# EAGLE design milton (EAGLE 8.4.1)
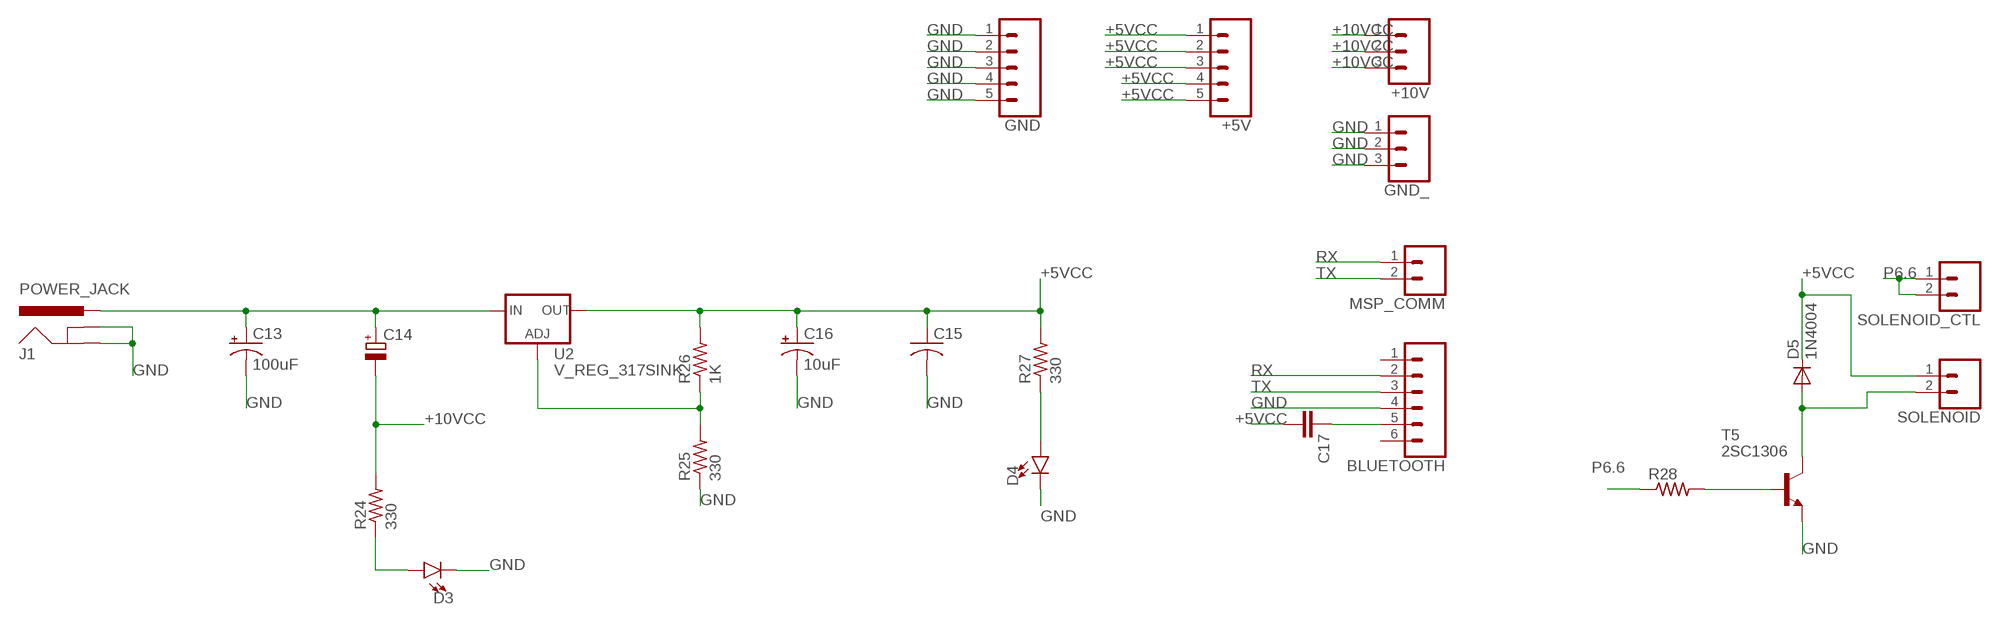
[diagram p0: schematic, sheet 1]

## Parts
+5V  CONN_05  [1X05]
+10V  CONN_03  [1X03]
BLUETOOTH  CONN_06SILK_FEMALE_PTH  [1X06]
C13  100uF  100UF-POLAR-RADIAL-2.5MM-25V-20%  [CPOL-RADIAL-2.5MM-6.5MM]
C14  CPOL-EUE5-6  [E5-6]
C15  C-US050-030X075  [C050-030X075]
C16  10uF  10UF-POLAR-RADIAL-2.5MM-25V-20%  [CPOL-RADIAL-2.5MM-5MM]
C17  C5/3  [C5B3]
D3  LED-RED1206  [LED-1206]
D4  LED-RED1206  [LED-1206]
D5  1N4004  [DO41-10]
GND  CONN_05  [1X05]
GND_  CONN_03  [1X03]
J1  POWER_JACK  [POWER_JACK_PTH]
MSP_COMM  CONN_02  [1X02]
R24  330  R-US_0207/10  [0207/10]
R25  330  R-US_0207/10  [0207/10]
R26  1K  R-US_0207/10  [0207/10]
R27  330  R-US_0207/10  [0207/10]
R28  R-US_0207/10  [0207/10]
SOLENOID  CONN_02  [1X02]
SOLENOID_CTL  CONN_02  [1X02]
T5  2SC1306  [TO220BV]
U2  V_REG_317SINK  [TO220-ADJ]

## Nets
+5VCC: +5V.1 +5V.2 +5V.3 +5V.4 +5V.5 C15.1 C16.1(+) C17.2 D5.C R26.2 R27.2 SOLENOID.1 U2.OUT
+10VCC: +10V.1 +10V.2 +10V.3 C14.- R24.2
GND: BLUETOOTH.4 C13.2(-) C15.2 C16.2(-) D3.C D4.C GND.1 GND.2 GND.3 GND.4 GND.5 GND_.1 GND_.2 GND_.3 J1.GND J1.GNDBREAK R25.1 T5.3(E)
N$22: C13.1(+) C14.+ J1.PWR U2.IN
N$25: D4.A R27.1
N$26: R25.2 R26.1 U2.ADJ
N$28: D3.A R24.1
N$29: BLUETOOTH.5 C17.1
N$30: R28.2 T5.1(B)
N$32: D5.A SOLENOID.2 T5.2(C)
P6.6: R28.1 SOLENOID_CTL.1 SOLENOID_CTL.2
RX: BLUETOOTH.2 MSP_COMM.1
TX: BLUETOOTH.3 MSP_COMM.2
Unconnected: BLUETOOTH.1 BLUETOOTH.6

## Library data of the parts
+5V GND = SparkFun-Connectors:CONN_05: Multi connection point. Often used as Generic Header-pin footprint for 0.1 inch spaced/style header connections On any of the 0.1 inch spaced packages, you can populate with these: Break Away Headers - Straight <https://www.sparkfun.com/products/116> (PRT-00116) Break Away Male Headers - Right Angle <https://www.sparkfun.com/products/553> (PRT-00553) Female Headers <https://www.sparkfun.com/products/115> (PRT-00115) Break Away Headers - Machine Pin <https://www.sparkfun.com/products/117> (PRT-00117) Break Away Female Headers - Swiss Machine Pin <https://www.sparkfun.com/products/743> (PRT-00743) For SCREWTERMINALS and SPRING TERMINALS visit here: Screw Terimnals on SparkFun.com <https://www.sparkfun.com/search/results?term=Screw+Terminals> (5mm/3.5mm/2.54mm spacing) This device is also useful as a general connection point to wire up your design to another part of your project. Our various solder wires solder well into these plated through hole pads. Hook-Up Wire - Assortment (Stranded, 22 AWG) <https://www.sparkfun.com/products/11375> (PRT-11375) Hook-Up Wire - Assortment (Solid Core, 22 AWG) <https://www.sparkfun.com/products/11367> (PRT-11367) View the entire wire category on our website here <https://www.sparkfun.com/categories/141> Special notes: Molex polarized connector foot print use with SKU : PRT-08231 with associated crimp pins and housings. 1MM SMD Version SKU: PRT-10208
+10V GND_ = SparkFun-Connectors:CONN_03: Multi connection point. Often used as Generic Header-pin footprint for 0.1 inch spaced/style header connections On any of the 0.1 inch spaced packages, you can populate with these: Break Away Headers - Straight <https://www.sparkfun.com/products/116> (PRT-00116) Break Away Male Headers - Right Angle <https://www.sparkfun.com/products/553> (PRT-00553) Female Headers <https://www.sparkfun.com/products/115> (PRT-00115) Break Away Headers - Machine Pin <https://www.sparkfun.com/products/117> (PRT-00117) Break Away Female Headers - Swiss Machine Pin <https://www.sparkfun.com/products/743> (PRT-00743) Stackable Header - 3 Pin (Female, 0.1") <https://www.sparkfun.com/products/13875> (PRT-13875) For SCREWTERMINALS and SPRING TERMINALS visit here: Screw Terimnals on SparkFun.com <https://www.sparkfun.com/search/results?term=Screw+Terminals> (5mm/3.5mm/2.54mm spacing) This device is also useful as a general connection point to wire up your design to another part of your project. Our various solder wires solder well into these plated through hole pads. Hook-Up Wire - Assortment (Stranded, 22 AWG) <https://www.sparkfun.com/products/11375> (PRT-11375) Hook-Up Wire - Assortment (Solid Core, 22 AWG) <https://www.sparkfun.com/products/11367> (PRT-11367) View the entire wire category on our website here <https://www.sparkfun.com/categories/141> Special notes: Molex polarized connector foot print use with SKU : PRT-08232 with associated crimp pins and housings.
BLUETOOTH = SparkFun-Connectors:CONN_06: Multi connection point. Often used as Generic Header-pin footprint for 0.1 inch spaced/style header connections On any of the 0.1 inch spaced packages, you can populate with these: Break Away Headers - Straight <https://www.sparkfun.com/products/116> (PRT-00116) Break Away Male Headers - Right Angle <https://www.sparkfun.com/products/553> (PRT-00553) Female Headers <https://www.sparkfun.com/products/115> (PRT-00115) Break Away Headers - Machine Pin <https://www.sparkfun.com/products/117> (PRT-00117) Break Away Female Headers - Swiss Machine Pin <https://www.sparkfun.com/products/743> (PRT-00743) Arduino Stackable Header - 6 Pin <https://www.sparkfun.com/products/9280> (PRT-09280) For SCREWTERMINALS and SPRING TERMINALS visit here: Screw Terimnals on SparkFun.com <https://www.sparkfun.com/search/results?term=Screw+Terminals> (5mm/3.5mm/2.54mm spacing) This device is also useful as a general connection point to wire up your design to another part of your project. Our various solder wires solder well into these plated through hole pads. Hook-Up Wire - Assortment (Stranded, 22 AWG) <https://www.sparkfun.com/products/11375> (PRT-11375) Hook-Up Wire - Assortment (Solid Core, 22 AWG) <https://www.sparkfun.com/products/11367> (PRT-11367) View the entire wire category on our website here <https://www.sparkfun.com/categories/141>; PROD_ID: CONN-08437
C13 = SparkFun-Capacitors:100UF-POLAR: 100µF polarized capacitors A capacitor is a passive two-terminal electrical component used to store electrical energy temporarily in an electric field.; PROD_ID: CAP-08439
C14 = resistor:CPOL-EU: POLARIZED CAPACITOR, European symbol
C15 = resistor:C-US: CAPACITOR, American symbol
C16 = SparkFun-Capacitors:10UF-POLAR: 10.0µF polarized capacitors A capacitor is a passive two-terminal electrical component used to store electrical energy temporarily in an electric field.; PROD_ID: CAP-08440
C17 = capacitor-wima:C: CAPACITOR naming: grid - package width
D3 D4 = SparkFun-LED:LED-RED: Red SMD LED Used in manufacturing of most products at SparkFun Packages: 0603 - SMD 0603 package [Product Link] <http://docs.avagotech.com/docs/AV02-0551EN> 0603 SMART - SMD 0603 SMART package ( more efficient and expensive)[Product Link] <http://www.osram-os.com/Graphics/XPic2/00077099_0.pdf> 1206 - SMD1206 package [Product Link] <https://www.sparkfun.com/datasheets/DevTools/LilyPad/Q150OVS4.pdff> SparkFun Products: Pro Mini 328 -5V <https://www.sparkfun.com/products/821> RedBoard <https://www.sparkfun.com/products/12757> IOIO-OTG <https://www.sparkfun.com/products/13613>; PROD_ID: DIO-09912; VALUE: RED
D5 = adafruit:1N4004: DIODE General purpose 1N400x type rectifier (With bigger pads) http://www.ladyada.net/library/pcb/eaglelibrary.html
J1 = SparkFun-Connectors:POWER_JACK: Power Jack Connector This is the standard 5.5mm barrel jack for power. The PTH is the most common, proven, reliable, footprint. The Slot footprint only works if the mill layer is transmitted to the PCB fab house so be warned. Here are the connectors we sell at SparkFun: DC Barrel Power Jack/Connector <https://www.sparkfun.com/products/119> (PRT-00119) DC Barrel Power Jack/Connector (SMD) <https://www.sparkfun.com/products/12748> (PRT-12748) DC Barrel Jack Adapter - Breadboard Compatible <https://www.sparkfun.com/products/10811> (PRT-10811) It is used on this SparkFun product (and many, many others): SparkFun RedBoard - Programmed with Arduino <https://www.sparkfun.com/products/12757> (DEV-12757) Also, if you need a mating power supply or connector, please check these out: Wall Adapter Power Supply - 9VDC 650mA <https://www.sparkfun.com/products/298> (TOL-00298) DC Barrel Jack Adapter - Male <https://www.sparkfun.com/products/10287> (PRT-10287); PROD_ID: CONN-08197
MSP_COMM SOLENOID SOLENOID_CTL = SparkFun-Connectors:CONN_02: Multi connection point. Often used as Generic Header-pin footprint for 0.1 inch spaced/style header connections On any of the 0.1 inch spaced packages, you can populate with these: Break Away Headers - Straight <https://www.sparkfun.com/products/116> (PRT-00116) Break Away Male Headers - Right Angle <https://www.sparkfun.com/products/553> (PRT-00553) Female Headers <https://www.sparkfun.com/products/115> (PRT-00115) Break Away Headers - Machine Pin <https://www.sparkfun.com/products/117> (PRT-00117) Break Away Female Headers - Swiss Machine Pin <https://www.sparkfun.com/products/743> (PRT-00743) For SCREWTERMINALS and SPRING TERMINALS visit here: Screw Terimnals on SparkFun.com <https://www.sparkfun.com/search/results?term=Screw+Terminals> (5mm/3.5mm/2.54mm spacing) This device is also useful as a general connection point to wire up your design to another part of your project. Our various solder wires solder well into these plated through hole pads. Hook-Up Wire - Assortment (Stranded, 22 AWG) <https://www.sparkfun.com/products/11375> (PRT-11375) Hook-Up Wire - Assortment (Solid Core, 22 AWG) <https://www.sparkfun.com/products/11367> (PRT-11367) View the entire wire category on our website here <https://www.sparkfun.com/categories/141> Special notes: Molex polarized connector foot print use with: PRT-08233 with associated crimp pins and housings. 2.54_SCREWTERM for use with PRT-10571. 3.5mm Screw Terminal footprints for PRT-08084 5mm Screw Terminal footprints for use with PRT-08432
R24-R28 = resistor:R-US_: RESISTOR, American symbol
T5 = transistor:2SC1306: NPN Transistor Final RF Power Outupt Source: 2sc1306.pdf
U2 = SparkFun-IC-Power:V_REG_317: Voltage Regulator Standard LM317 adjustable voltage regulator. AOI (Adjust Output Input). Google 'LM317 Calculator' for easy to use app to get the two resistor values needed. 240/720 for 5V output. 240/390 for 3.3V output. Spark Fun Electronics SKU : COM-00527

## Board
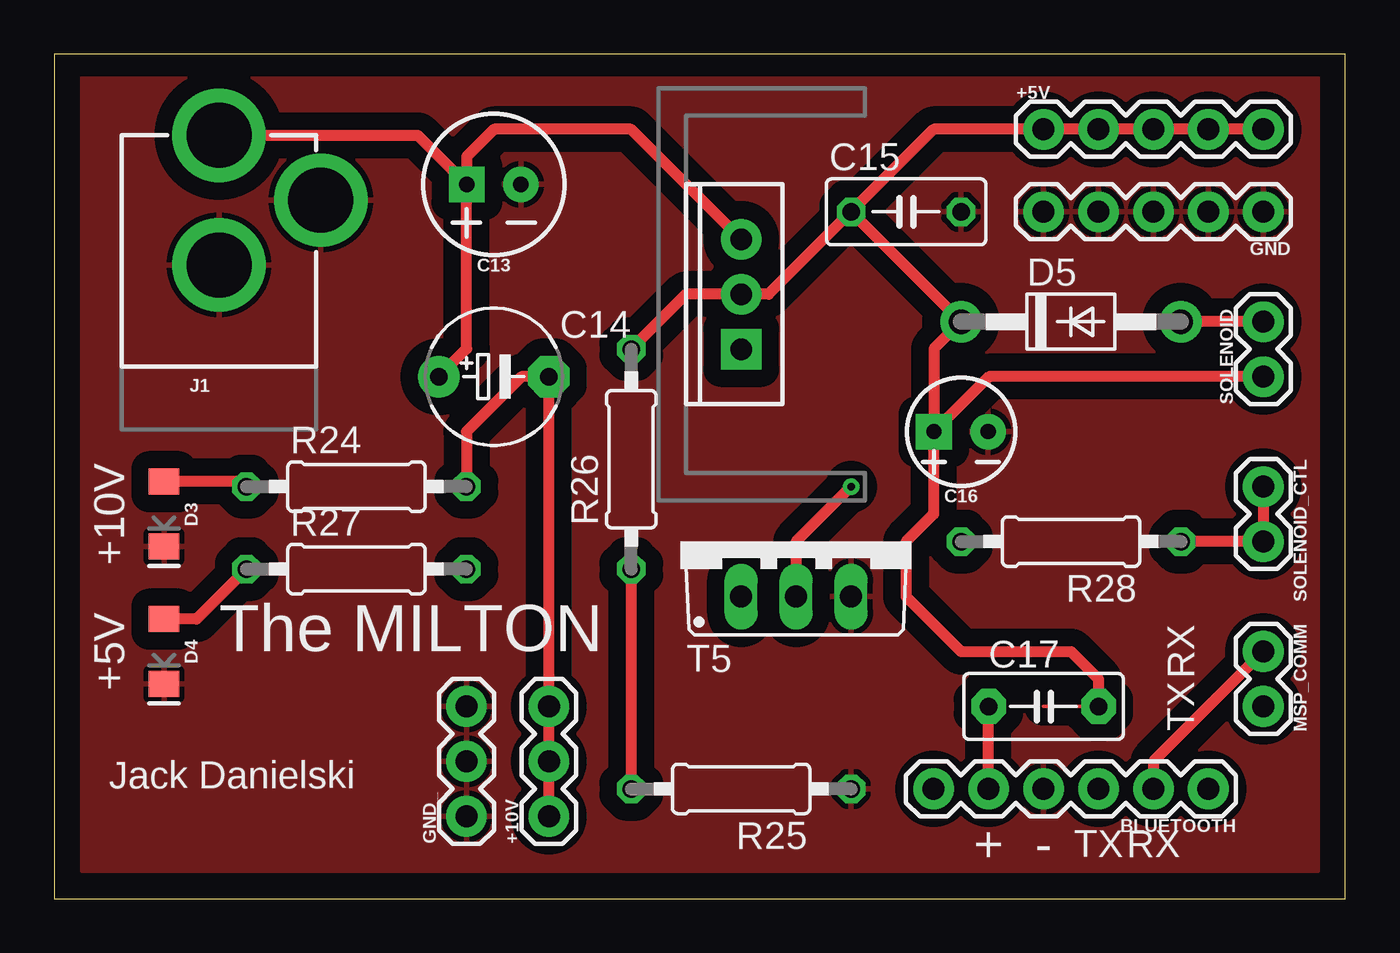
[diagram p1: board, top side]
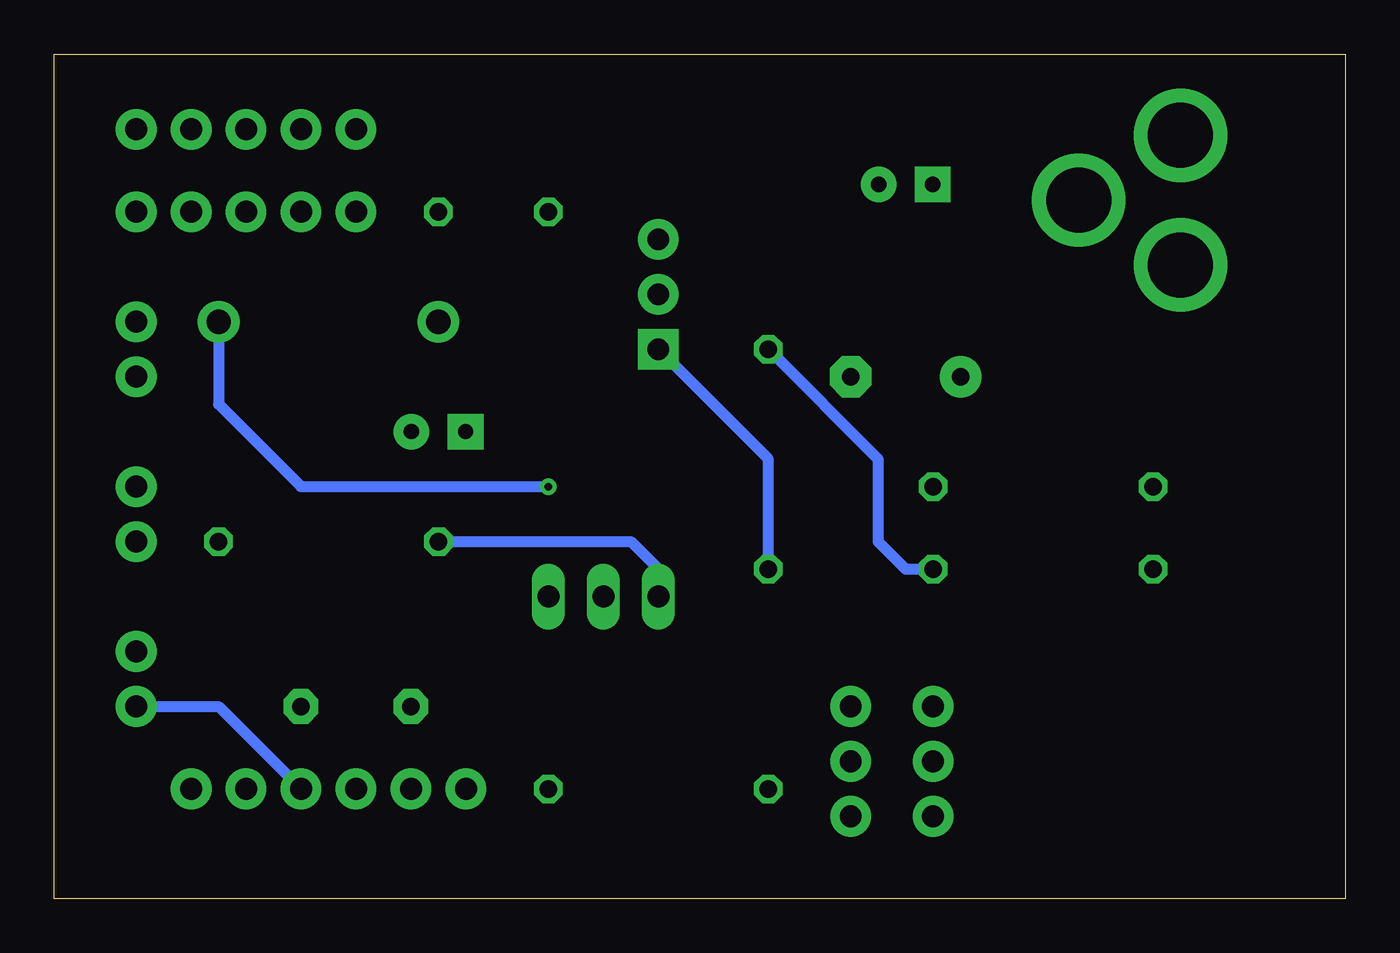
[diagram p2: board, bottom side, seen from below]

Size 59.67 x 39.04 mm. Coordinates in mm from the lower left corner, seen from the top.
Outline: 0,0 59.67,0 59.67,39.04 0,39.04 0,0
Copper layers (1*16): Top 0.035mm / dielectric 1.5mm / Bottom 0.035mm
Design rules "default": minimum track width 6mil, minimum drill 0.35mm, track to track 6mil, track to pad 6mil, pad to pad 6mil, via to via 6mil, smd to smd 6mil, copper to edge 40mil, drill to drill 6mil, minimum pad ring 10mil, minimum via ring 8mil, stop-mask expansion 4mil, vias tented up to drill 0mil, thermal gap 10mil

### Footprints (pad centres in the part's own frame; a part is rotated, then mirrored left to right if it is on the bottom)
1X05 = drill 1.016 pad 1.88: 1 0,0; 2 2.54,0; 3 5.08,0; 4 7.62,0; 5 10.16,0
1X03 = drill 1.016 pad 1.88: 1 0,0; 2 2.54,0; 3 5.08,0
1X06 = drill 1.016 pad 1.88: 1 0,0; 2 2.54,0; 3 5.08,0; 4 7.62,0; 5 10.16,0; 6 12.7,0
CPOL-RADIAL-2.5MM-6.5MM = drill 0.7 pad 1.651 square: 1 1.25,0 | drill 0.7 pad 1.651: 2 -1.25,0
E5-6 = drill 0.813 pad 1.905: + -2.54,0 | drill 0.813 pad 1.905 octagon: - 2.54,0
C050-030X075 = drill 0.813 octagon: 1 -2.54,0; 2 2.54,0
CPOL-RADIAL-2.5MM-5MM = drill 0.7 pad 1.651 square: 1 1.25,0 | drill 0.7 pad 1.651: 2 -1.25,0
C5B3 = drill 0.813 pad 1.6 octagon: 1 -2.54,0; 2 2.54,0
LED-1206 = smd 1.2 x 1.4: A -1.5,0; C 1.5,0
DO41-10 = drill 1.118 pad 1.93: A 5.08,0; C -5.08,0
POWER_JACK_PTH = drill 2.997 pad 4.318: GND 0,7.7; GNDBREAK 4.7,10.7; PWR 0,13.7
1X02 = drill 1.016 pad 1.88: 1 0,0; 2 2.54,0
0207/10 = drill 0.813 octagon: 1 -5.08,0; 2 5.08,0
TO220BV = drill 1.016 long: 1 -2.54,-2.54; 2 0,-2.54; 3 2.54,-2.54
TO220-ADJ = drill 1 pad 1.88 square: ADJ -2.54,0 | drill 1 pad 1.88: IN 2.54,0; OUT 0,0

### Placement (x,y rotation side)
+5V  45.72,35.56 0 top
+10V  22.86,3.81 90 top
BLUETOOTH  53.34,5.08 180 top
C13  20.32,33.02 180 top
C14  20.32,24.13 0 top
C15  39.37,31.75 0 top
C16  41.91,21.59 180 top
C17  45.72,8.89 0 top
D3  5.08,17.78 270 top
D4  5.08,11.43 270 top
D5  46.99,26.67 0 top
GND  55.88,31.75 180 top
GND_  19.05,3.81 90 top
J1  7.62,21.59 0 top
MSP_COMM  55.88,11.43 270 top
R24  13.97,19.05 0 top
R25  31.75,5.08 180 top
R26  26.67,20.32 90 top
R27  13.97,15.24 0 top
R28  46.99,16.51 180 top
SOLENOID  55.88,24.13 90 top
SOLENOID_CTL  55.88,19.05 270 top
T5  34.29,16.51 0 top
U2  31.75,27.94 90 top

### Tracks (layer width: path | path; a pad name or v marks a point on that pad's centre or on a via)
+5VCC
  Top 0.152: C16.1 40.64,21.57 | C17.2 45.72,8.89
  Top 0.508: C16.1 40.66,25.42 D5.C C15.1 | SOLENOID.1 43.2,24.13 C16.1 | R26.2 29.21,27.94 U2.OUT 33.02,27.94 C15.1 | C15.1 40.64,35.56 +5V.1 +5V.2 +5V.3 +5V.4 +5V.5 | C16.1 40.64,21.57 40.64,17.78 39.37,16.51 39.37,13.97 41.91,11.43 46.99,11.43 48.26,10.16 C17.2
  Bottom 0.508: R26.2 21.59,20.32 21.59,16.51 20.32,15.24 R27.2
+10VCC
  Top 0.508: R24.2 19.05,21.59 21.59,24.13 C14.- +10V.3 +10V.2 +10V.1
GND
  pour Top (isolate 0.813): 1.27,38.1 1.27,1.27 58.42,1.27 58.42,38.1
N$22
  Top 0.508: C13.1 18.8,32.75 | C14.+ 19.07,25.42 C13.1 | U2.IN 26.67,35.56 20.32,35.56 19.07,34.31 C13.1 | J1.PWR 16.8,35.29 C13.1
N$25
  Top 0.508: R27.1 6.58,12.93 D4.A
N$26
  Top 0.508: R26.1 R25.2
  Bottom 0.508: R26.1 26.67,20.32 U2.ADJ
N$28
  Top 0.508: R24.1 8.66,19.28 D3.A
N$29
  Top 0.508: BLUETOOTH.5 C17.1
N$30
  Bottom 0.508: R28.2 33.02,16.51 31.75,15.24 T5.1
N$32  (via drill 0.35)
  Top 0.508: SOLENOID.2 D5.A | v36.83,19.05 34.29,16.51 T5.2
  Bottom 0.508: D5.A 52.07,22.86 48.26,19.05 v36.83,19.05
P6.6
  Top 0.508: R28.1 SOLENOID_CTL.2 SOLENOID_CTL.1
RX
  Top 0.508: MSP_COMM.1 50.8,6.35 BLUETOOTH.2
TX
  Bottom 0.508: MSP_COMM.2 52.07,8.89 BLUETOOTH.3

### Text on the board
tPlace: +10V | +5V | The MILTON | RX | TX | Jack Danielski | + | - | TX | RX
tValues: Project